# Altium schematic sheet stepsticktester.SchDoc
size 464 x 373 mm
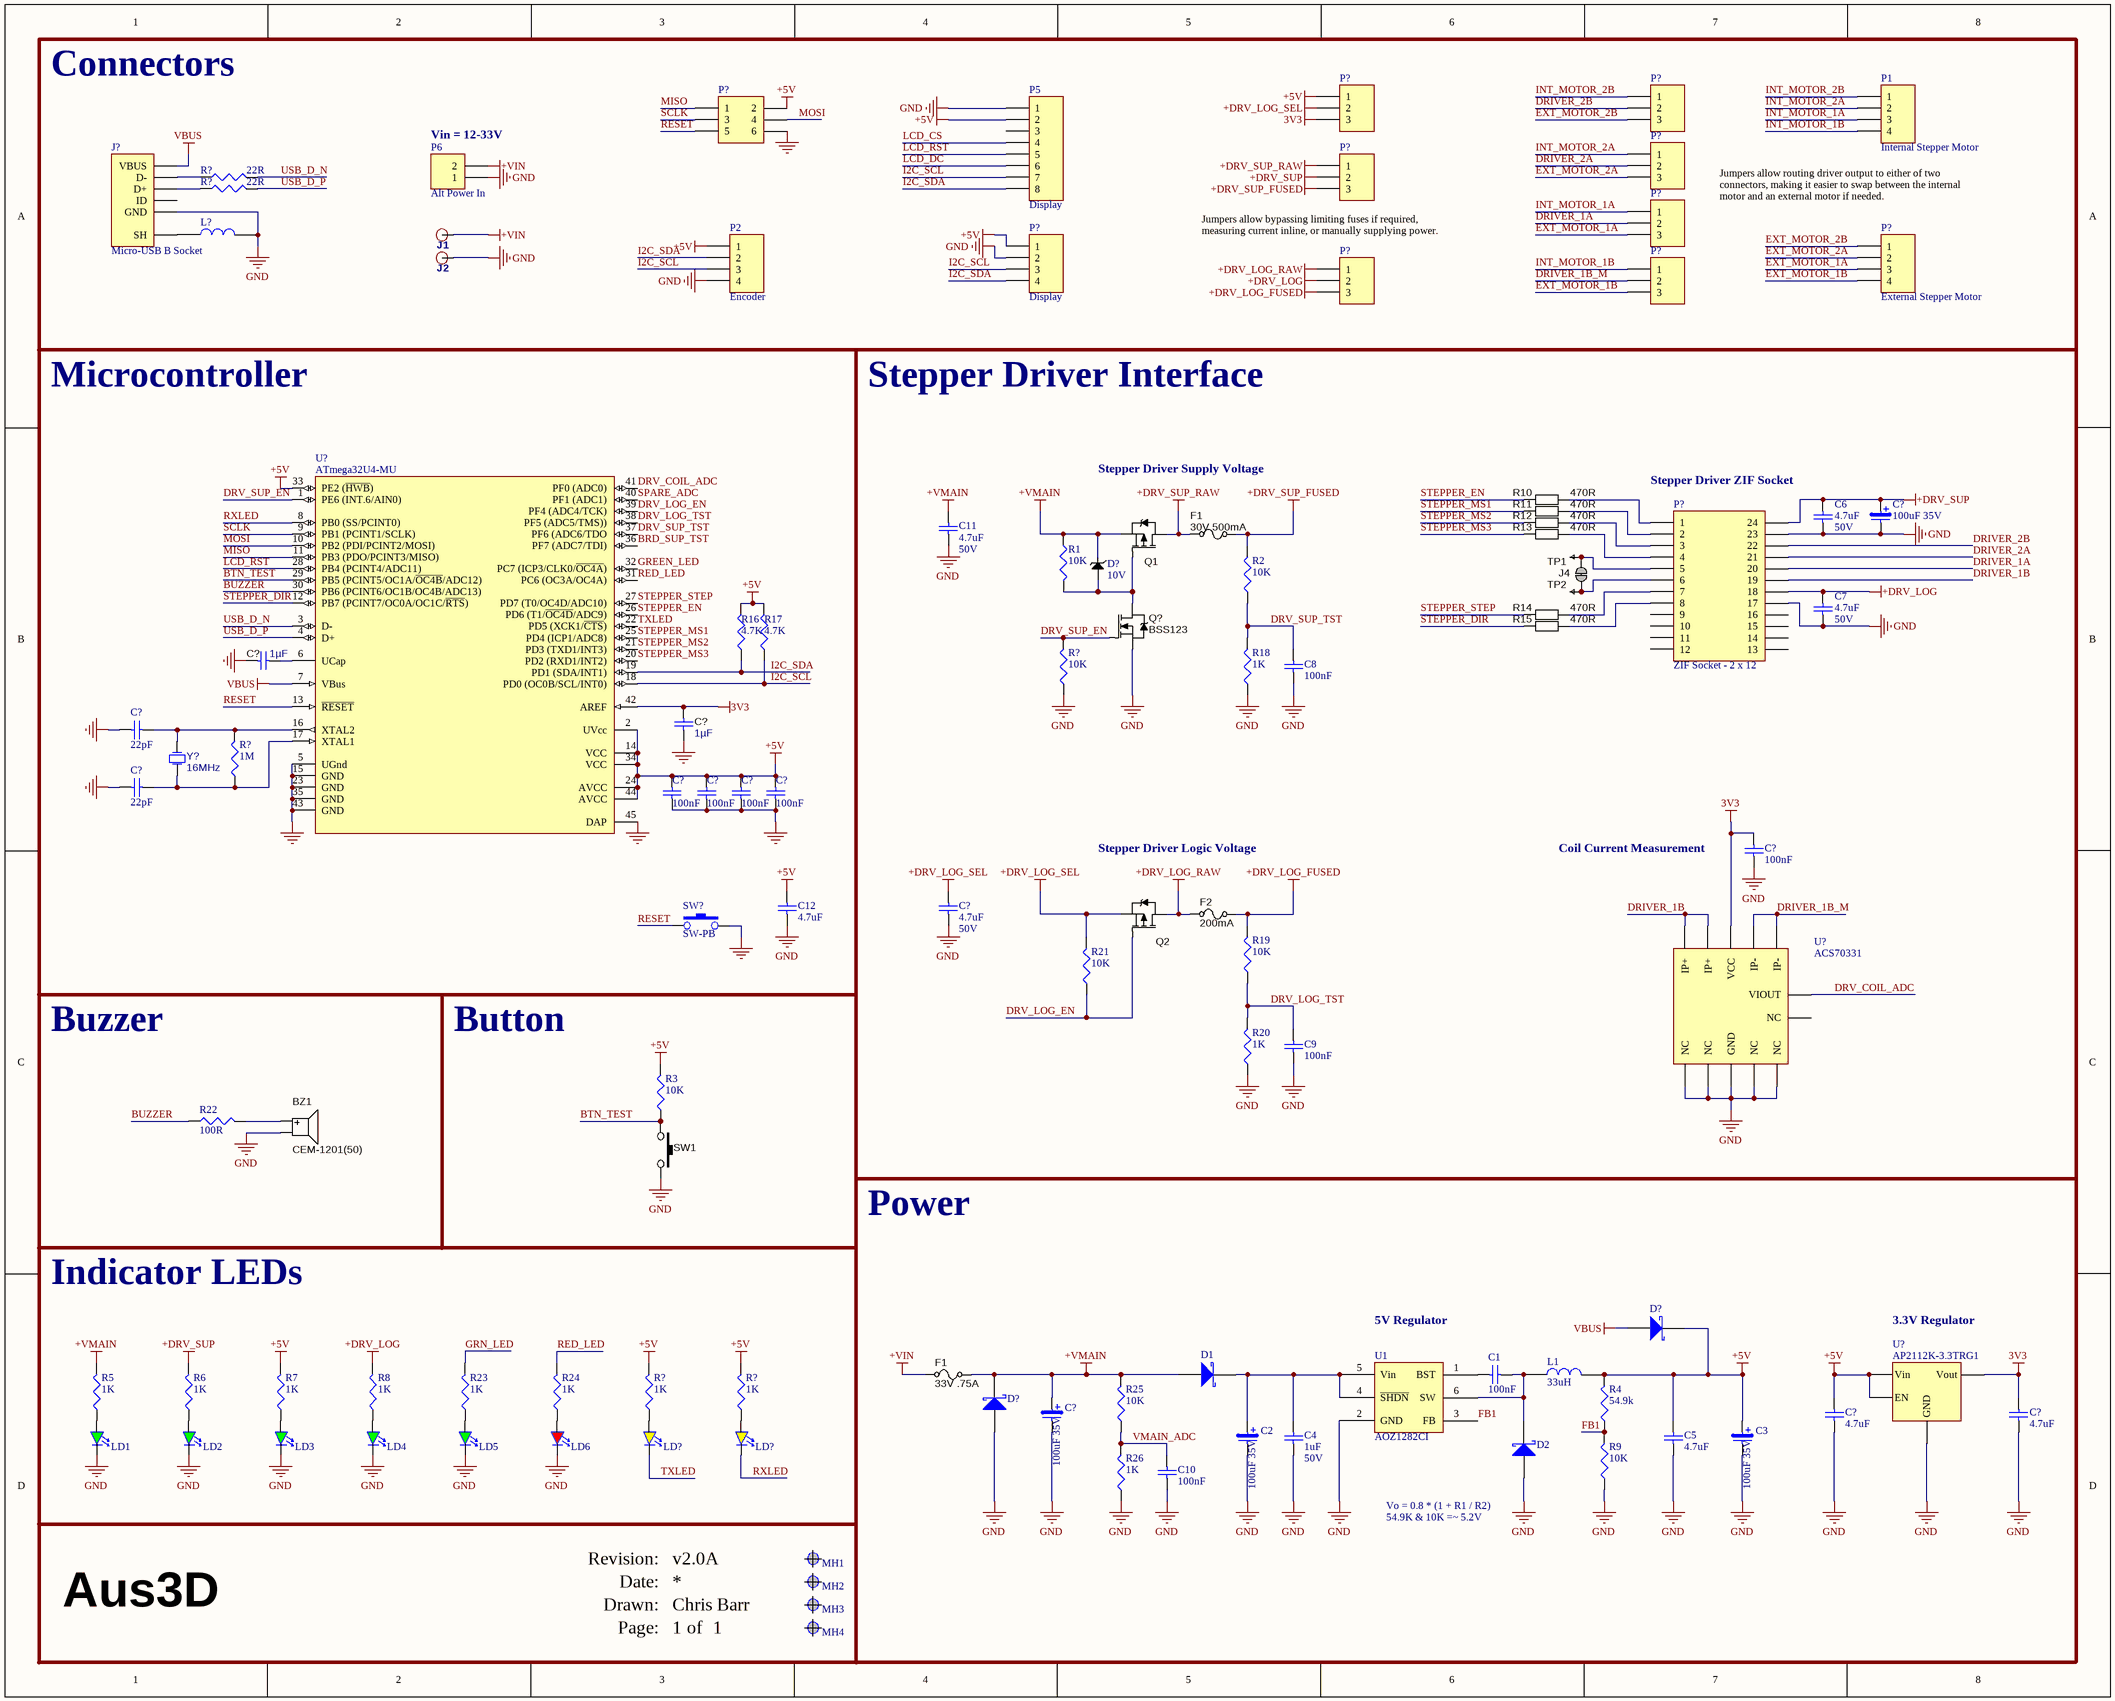
[diagram p0: stepsticktester.SchDoc]

## Parts
(Parts that share a designator on the sheet are numbered #1, #2 ... from top to bottom, then left to right.)
BZ1  Manufacturer Part Number 1: CEM-1201(50)  [BUZZER_12.0X8.5MM]  (hidden comment: 5V Buzzer, 6.5mm TH leads)
C1  value 100nF  [Cap 1608-0603]  (hidden comment: CapC-0603-100nF)
C2  value 100uF 35V  [CAP EL PANASONIC]  (hidden comment: CapE-6.3-100uF-35V)
C3  value 100uF 35V  [CAP EL PANASONIC]  (hidden comment: CapE-6.3-100uF-35V)
C4  value 1uF  Voltage: 50V  [Cap 1608-0603]  (hidden comment: CapC-0603-1uF 50V)
C5  value 4.7uF  [Cap 1608-0603]  (hidden comment: CapC-0603-4.7uF)
C6  value 4.7uF  Voltage: 50V  [CAP 3225-1210]  (hidden comment: CapC-1210-4.7uF-50V)
C7  value 4.7uF  Voltage: 50V  [CAP 3225-1210]  (hidden comment: CapC-1210-4.7uF-50V)
C8  value 100nF  [Cap 1608-0603]  (hidden comment: CapC-0603-100nF)
C9  value 100nF  [Cap 1608-0603]  (hidden comment: CapC-0603-100nF)
C10  value 100nF  [Cap 1608-0603]  (hidden comment: CapC-0603-100nF)
C11  value 4.7uF  Voltage: 50V  [CAP 3225-1210]  (hidden comment: CapC-1210-4.7uF-50V)
C12  value 4.7uF  [Cap 1608-0603]  (hidden comment: CapC-0603-4.7uF)
C?#1  value 100uF 35V  [CAP EL PANASONIC]  (hidden comment: CapE-6.3-100uF-35V)
C?#2  value 1µF  [Cap 1608-0603]  (hidden comment: approved sub OK)
C?#3  value 1µF  [Cap 1608-0603]  (hidden comment: approved sub OK)
C?#4  value 22pF  [Cap 1608-0603]  (hidden comment: CapC-0603-22pF)
C?#5  value 22pF  [Cap 1608-0603]  (hidden comment: CapC-0603-22pF)
C?#6  value 100nF  [Cap 1608-0603]  (hidden comment: CapC-0603-100nF)
C?#7  value 100nF  [Cap 1608-0603]  (hidden comment: CapC-0603-100nF)
C?#8  value 100nF  [Cap 1608-0603]  (hidden comment: CapC-0603-100nF)
C?#9  value 100nF  [Cap 1608-0603]  (hidden comment: CapC-0603-100nF)
C?#10  value 100nF  [Cap 1608-0603]  (hidden comment: CapC-0603-100nF)
C?#11  value 4.7uF  Voltage: 50V  [CAP 3225-1210]  (hidden comment: CapC-1210-4.7uF-50V)
C?#12  value 100uF 35V  [CAP EL PANASONIC]  (hidden comment: CapE-6.3-100uF-35V)
C?#13  value 4.7uF  [Cap 1608-0603]  (hidden comment: CapC-0603-4.7uF)
C?#14  value 4.7uF  [Cap 1608-0603]  (hidden comment: CapC-0603-4.7uF)
D1  Diode Schottky 2A 40V  [DIOM2616X08N]  (value not drawn)
D2  Diode Schottky 2A 40V  [DIOM2616X08N]  (value not drawn)
D?#1  Voltage: 10V  [SOD523]  (hidden comment: Diode Zener 10V)
D?#2  Diode Schottky 2A 40V  [DIOM2616X08N]  (value not drawn)
D?#3  Diode Schottky 2A 40V  [DIOM2616X08N]  (value not drawn)
F1#1  value 30V 500mA  [CAPC4532X280N]  (hidden comment: PTC Resettable Fuse)
F1#2  value 33V .75A  [CAPC4532X280N]  (hidden comment: PTC Resettable Fuse)
F2  value 200mA  [RES 3216-1206]  (hidden comment: PTC Resettable Fuse)
J1  Through-hole banana jack  [BANANA_CONN]  (value not drawn)  (no BOM)
J2  Through-hole banana jack  [BANANA_CONN]  (value not drawn)  (no BOM)
J4  Jumper  [JUMPER-2-NC_BY_PASTE]  (value not drawn)  (no BOM)
J?  Micro-USB B Socket  [Micro-USB B Molex 105017-0001]
L1  value 33uH  [SRN6045TA SMD Inductor]  (hidden comment: Inductor SMD 33uH 2.5A)
L?  Ferrite Bead SMD 0805  [Res 2012-0805]  (value not drawn)
LD1  GREEN  [LED 1608-0603]  (value not drawn)
LD2  GREEN  [LED 1608-0603]  (value not drawn)
LD3  GREEN  [LED 1608-0603]  (value not drawn)
LD4  GREEN  [LED 1608-0603]  (value not drawn)
LD5  GREEN  [LED 1608-0603]  (value not drawn)
LD6  RED  [LED 1608-0603]  (value not drawn)
LD?#1  YELLOW  [LED 1608-0603]  (value not drawn)
LD?#2  YELLOW  [LED 1608-0603]  (value not drawn)
MH1  Screw Hole  [M3-Hole-2]  (value not drawn)  (no BOM)
MH2  Screw Hole  [M3-Hole-2]  (value not drawn)  (no BOM)
MH3  Screw Hole  [M3-Hole-2]  (value not drawn)  (no BOM)
MH4  Screw Hole  [M3-Hole-2]  (value not drawn)  (no BOM)
P1  Internal Stepper Motor  [HDR1X4-HEADER]  (no BOM)
P2  Encoder  [HDR1X4-HEADER]  (no BOM)
P5  Display  [HDR1X8-HEADER]  (no BOM)
P6  Alt Power In  [HDR1X2-HEADER]  (no BOM)
P?#1  Header 3  [HDR1X3-HEADER]  (value not drawn)
P?#2  Header 3  [HDR1X3-HEADER]  (value not drawn)
P?#3  Header 3X2  [HDR2X3-Header]  (value not drawn)
P?#4  Header 3  [HDR1X3-HEADER]  (value not drawn)
P?#5  Header 3  [HDR1X3-HEADER]  (value not drawn)
P?#6  Header 3  [HDR1X3-HEADER]  (value not drawn)
P?#7  Display  [HDR1X4-HEADER]  (no BOM)
P?#8  External Stepper Motor  [HDR1X4-HEADER]  (no BOM)
P?#9  Header 3  [HDR1X3-HEADER]  (value not drawn)
P?#10  Header 3  [HDR1X3-HEADER]  (value not drawn)
P?#11  ZIF Socket - 2 x 12  [ZIF Socket - 2 x 12]
Q1  DMP3099L-7  [SOT23-3 New]  (value not drawn)
Q2  DMP3099L-7  [SOT23-3 New]  (value not drawn)
Q?  BSS123  [SOT23-3]
R1  value 10K  [RES 1608-0603]  (hidden comment: Res-0603-10K)
R2  value 10K  [RES 1608-0603]  (hidden comment: Res-0603-10K)
R3  value 10K  [RES 1608-0603]  (hidden comment: Res-0603-10K)
R4  value 54.9k  [RES 1608-0603]  (hidden comment: Res-0603-54K9)
R5  value 1K  [RES 1608-0603]  (hidden comment: Res-0603-1K)
R6  value 1K  [RES 1608-0603]  (hidden comment: Res-0603-1K)
R7  value 1K  [RES 1608-0603]  (hidden comment: Res-0603-1K)
R8  value 1K  [RES 1608-0603]  (hidden comment: Res-0603-1K)
R9  value 10K  [RES 1608-0603]  (hidden comment: Res-0603-10K)
R10  value 470R  [RESC1608X55N]  (hidden comment: Thick Film)
R11  value 470R  [RESC1608X55N]  (hidden comment: Thick Film)
R12  value 470R  [RESC1608X55N]  (hidden comment: Thick Film)
R13  value 470R  [RESC1608X55N]  (hidden comment: Thick Film)
R14  value 470R  [RESC1608X55N]  (hidden comment: Thick Film)
R15  value 470R  [RESC1608X55N]  (hidden comment: Thick Film)
R16  value 4.7K  [RES 1608-0603]  (hidden comment: Res-0603-4K7)
R17  value 4.7K  [RES 1608-0603]  (hidden comment: Res-0603-4K7)
R18  value 1K  [RES 1608-0603]  (hidden comment: Res-0603-1K)
R19  value 10K  [RES 1608-0603]  (hidden comment: Res-0603-10K)
R20  value 1K  [RES 1608-0603]  (hidden comment: Res-0603-1K)
R21  value 10K  [RES 1608-0603]  (hidden comment: Res-0603-10K)
R22  value 100R  [RES 1608-0603]  (hidden comment: Res-0603-100R)
R23  value 1K  [RES 1608-0603]  (hidden comment: Res-0603-1K)
R24  value 1K  [RES 1608-0603]  (hidden comment: Res-0603-1K)
R25  value 10K  [RES 1608-0603]  (hidden comment: Res-0603-10K)
R26  value 1K  [RES 1608-0603]  (hidden comment: Res-0603-1K)
R?#1  value 22R  [RES 1608-0603]  (hidden comment: Res-0603-22R)
R?#2  value 22R  [RES 1608-0603]  (hidden comment: Res-0603-22R)
R?#3  value 10K  [RES 1608-0603]  (hidden comment: Res-0603-10K)
R?#4  value 1M  [RES 1608-0603]  (hidden comment: Res-0603-1M)
R?#5  value 1K  [RES 1608-0603]  (hidden comment: Res-0603-1K)
R?#6  value 1K  [RES 1608-0603]  (hidden comment: Res-0603-1K)
SW1  Tactile Button - Omron B3F-5050  [Tactile Button - B3F-5050]  (value not drawn)  (no BOM)
SW?  SW-PB  [SW-PB SMD 2pin]
TP1  TESTPOINT  [THP_D38_T75_B75]  (value not drawn)  (no BOM)
TP2  TESTPOINT  [THP_D38_T75_B75]  (value not drawn)  (no BOM)
U1  AOZ1282CI  [SOT23-6N]
U?#1  ATmega32U4-MU  [44PW_N]
U?#2  ACS70331
U?#3  AP2112K-3.3TRG1  [SOT23-5]
Y?  16MHz  [3525 SMD Crystal]

## Blocks framed on the sheet
Connectors: J1 J2 J? L? P1 P2 P5 P6 P?#1-P?#10 R?#1 R?#2
Microcontroller: C12 C?#2-C?#9 R16 R17 R?#4 SW? U?#1 Y?
Stepper Driver Interface: C6-C9 C11 C?#1 C?#10 C?#11 D?#1 F1#1 F2 J4 P?#11 Q1 Q2 Q? R1 R2 R10-R15 R18-R21 R?#3 TP1 TP2 U?#2
Buzzer: BZ1 R22
Button: R3 SW1
Power: C1-C5 C10 C?#12-C?#14 D1 D2 D?#2 D?#3 F1#2 L1 R4 R9 R25 R26 U1 U?#3
Indicator LEDs: LD1-LD6 LD?#1 LD?#2 R5-R8 R23 R24 R?#5 R?#6
Aus3D: MH1-MH4

## Nets
3V3: C?#3.1 C?#10.2 C?#14.2 P?#1.3 U?#1.42(AREF) U?#2.6(VCC) U?#3.5(Vout)
+5V: C3.1 C5.2 C12.2 C?#6.2 C?#7.2 C?#8.2 C?#9.2 C?#13.2 D?#2.K L1.2 P2.1 P5.2 P?#1.1 P?#3.2 P?#7.1 R3.2 R4.2 R7.2 R16.2 R17.2 R?#5.2 R?#6.2 U?#1.2(UVcc) U?#1.14(VCC) U?#1.24(AVCC) U?#1.33(PE2_(~{HWB})) U?#1.34(VCC) U?#1.44(AVCC) U?#3.1(Vin) U?#3.3(EN)
+DRV_LOG: C7.2 P?#9.2 P?#11.18 R8.2
+DRV_LOG_FUSED: F2.2 P?#9.3 R19.2
+DRV_LOG_RAW: F2.1 P?#9.1 Q2.3(D)
+DRV_LOG_SEL: C?#11.2 P?#1.2 Q2.2(S) R21.2
+DRV_SUP: C6.2 C?#1.1 P?#5.2 P?#11.24 R6.2
+DRV_SUP_FUSED: F1#1.2 P?#5.3 R2.2
+DRV_SUP_RAW: F1#1.1 P?#5.1 Q1.3(D)
+VIN: F1#2.1 J1.P$1 P6.2
+VMAIN: C11.2 C?#12.1 D1.A D?#1.K D?#3.K F1#2.2 Q1.2(S) R1.1 R5.2 R25.2
GND: BZ1.2(Negative) C2.2 C3.2 C4.1 C5.1 C6.1 C7.1 C8.2 C9.2 C10.2 C11.1 C12.1 C?#1.2 C?#2.1 C?#3.2 C?#4.2 C?#5.2 C?#6.1 C?#7.1 C?#8.1 C?#9.1 C?#10.1 C?#11.1 C?#12.2 C?#13.1 C?#14.1 D2.A D?#3.A J2.P$1 J?.GND L?.2 LD1.2(K) LD2.2(K) LD3.2(K) LD4.2(K) LD5.2(K) LD6.2(K) P2.4 P5.1 P6.1 P?#3.6 P?#7.2 P?#11.17 P?#11.23 Q?.2(S) R9.1 R18.1 R20.1 R26.1 R?#3.1 SW1.1 SW?.2 U1.2(GND) U?#1.5(UGnd) U?#1.15(GND) U?#1.23(GND) U?#1.35(GND) U?#1.43(GND) U?#1.45(DAP) U?#2.5(GND) U?#2.6(NC) U?#2.8(NC) U?#2.9(NC) U?#2.11(NC) U?#3.2(GND)
VBUS: D?#2.A J?.VBUS U?#1.7(VBus)
BRD_SUP_TST: U?#1.36(PF7_(ADC7/TDI))
BTN_TEST: R3.1 SW1.2 U?#1.29(PB5_(PCINT5/OC1A/~{OC4B}/ADC12))
BUZZER: R22.1 U?#1.30(PB6_(PCINT6/OC1B/OC4B/ADC13))
DRIVER_1A: P?#6.2 P?#11.20
DRIVER_1B: P?#11.19 U?#2.1(IP+) U?#2.2(IP+)
DRIVER_1B_M: P?#10.2 U?#2.3(IP-) U?#2.4(IP-)
DRIVER_2A: P?#4.2 P?#11.21
DRIVER_2B: P?#2.2 P?#11.22
DRV_COIL_ADC: U?#1.41(PF0_(ADC0)) U?#2.10(VIOUT)
DRV_LOG_EN: Q2.1(G) R21.1 U?#1.39(PF4_(ADC4/TCK))
DRV_LOG_TST: C9.1 R19.1 R20.2 U?#1.38(PF5_(ADC5/TMS)))
DRV_SUP_EN: Q?.1(G) R?#3.2 U?#1.1(PE6_(INT.6/AIN0))
DRV_SUP_TST: C8.1 R2.1 R18.2 U?#1.37(PF6_(ADC6/TDO)
EXT_MOTOR_1A: P?#6.3 P?#8.3
EXT_MOTOR_1B: P?#8.4 P?#10.3
EXT_MOTOR_2A: P?#4.3 P?#8.2
EXT_MOTOR_2B: P?#2.3 P?#8.1
FB1: R4.1 R9.2 U1.3(FB)
GREEN_LED: U?#1.32(PC7_(ICP3/CLK0/~{OC4A}))
GRN_LED: R23.2
I2C_SCL: P2.3 P5.7 P?#7.3 R17.1 U?#1.18(PD0_(OC0B/SCL/INT0))
I2C_SDA: P2.2 P5.8 P?#7.4 R16.1 U?#1.19(PD1_(SDA/INT1))
INT_MOTOR_1A: P1.3 P?#6.1
INT_MOTOR_1B: P1.4 P?#10.1
INT_MOTOR_2A: P1.2 P?#4.1
INT_MOTOR_2B: P1.1 P?#2.1
LCD_CS: P5.4
LCD_DC: P5.6
LCD_RST: P5.5 U?#1.28(PB4_(PCINT4/ADC11))
MISO: P?#3.1 U?#1.11(PB3_(PDO/PCINT3/MISO))
MOSI: P?#3.4 U?#1.10(PB2_(PDI/PCINT2/MOSI))
RED_LED: R24.2 U?#1.31(PC6_(OC3A/OC4A))
RESET: P?#3.5 SW?.1 U?#1.13(~{RESET})
RXLED: LD?#2.2(K) U?#1.8(PB0_(SS/PCINT0))
SCLK: P?#3.3 U?#1.9(PB1_(PCINT1/SCLK))
SPARE_ADC: U?#1.40(PF1_(ADC1))
STEPPER_DIR: R15.1 U?#1.12(PB7_(PCINT7/OC0A/OC1C/~{RTS}))
STEPPER_EN: R10.1 U?#1.26(PD6_(T1/~{OC4D}/ADC9))
STEPPER_MS1: R11.1 U?#1.25(PD4_(ICP1/ADC8))
STEPPER_MS2: R12.1 U?#1.21(PD3_(TXD1/INT3))
STEPPER_MS3: R13.1 U?#1.20(PD2_(RXD1/INT2))
STEPPER_STEP: R14.1 U?#1.27(PD7_(T0/OC4D/ADC10))
TXLED: LD?#1.2(K) U?#1.22(PD5_(XCK1/~{CTS}))
USB_D_N: R?#1.2 U?#1.3(D-)
USB_D_P: R?#2.2 U?#1.4(D+)
VMAIN_ADC: C10.1 R25.1 R26.2
NetBZ1_1: BZ1.1(Positive) R22.2
NetC1_1: C1.1 D2.K L1.1 U1.6(SW)
NetC1_2: C1.2 U1.1(BST)
NetC2_1: C2.1 C4.2 D1.K U1.4(~{SHDN}) U1.5(Vin)
NetC?#2_2: C?#2.2 U?#1.6(UCap)
NetC?#4_1: C?#4.1 R?#4.2 U?#1.16(XTAL2) Y?.3(OSC2)
NetC?#5_1: C?#5.1 R?#4.1 U?#1.17(XTAL1) Y?.1(OSC1)
NetD?#1_A: D?#1.A Q1.1(G) Q?.3(D) R1.2
NetJ4_1: J4.1 P?#11.5 TP1.1
NetJ4_2: J4.2 P?#11.6 TP2.1
NetJ?_D+: J?.D+ R?#2.1
NetJ?_D-: J?.D- R?#1.1
NetJ?_SHIELD: J?.SHIELD(SH) L?.1
NetLD1_1: LD1.1(A) R5.1
NetLD2_1: LD2.1(A) R6.1
NetLD3_1: LD3.1(A) R7.1
NetLD4_1: LD4.1(A) R8.1
NetLD5_1: LD5.1(A) R23.1
NetLD6_1: LD6.1(A) R24.1
NetLD?#1_1: LD?#1.1(A) R?#5.1
NetLD?#2_1: LD?#2.1(A) R?#6.1
NetP?#11_1: P?#11.1 R10.2
NetP?#11_2: P?#11.2 R11.2
NetP?#11_3: P?#11.3 R12.2
NetP?#11_4: P?#11.4 R13.2
NetP?#11_7: P?#11.7 R14.2
NetP?#11_8: P?#11.8 R15.2

Not connected (* = marked no-connect by the designer): J? ID; MH1 M3(0); MH2 M3(0); MH3 M3(0); MH4 M3(0); P5 3; P?#11 9 10 11 12 13 14 15 16; U?#2 7(NC)

## Notes on the sheet
- (near P6) Vin = 12-33V
- Jumpers allow routing driver output to either of two connectors, making it easier to swap between the internal motor and an external motor if needed.
- (near P?#5) Jumpers allow bypassing limiting fuses if required, measuring current inline, or manually supplying power.
- Stepper Driver Supply Voltage
- Stepper Driver ZIF Socket
- Stepper Driver Logic Voltage
- Coil Current Measurement
- 5V Regulator
- 3.3V Regulator
- Vo = 0.8 * (1 + R1 / R2)
- 54.9K & 10K =~ 5.2V
- Date:
- Revision:
- v2.0A
- Drawn:
- Page:
- Chris Barr
- 1
- of

## Library data of the parts
BZ1 = BZ_12x8.5x6.5_2kHz: Speaker, Magnetic Transducer; Manufacturer 1: CUI Inc; Ratings: 2048 ±200 Hz; SCDType: source; Substitute: Sub OK; Package / Case: 6.5mm pitch; Material: Noryl SE1-J; Supplier 1: Digi-Key; Supplier Part Number 1: 102-1152-ND
C1 C8-C10 = CapC-0603-100nF: Capacitor (Semiconductor SIM Model); Note: Approved sub OK; Substitute: Sub OK; Published: 8-Jun-2000; Revision: July-2002: Re-released for DXP Platform.; Publisher: Altium Limited; Supplier 1: Digi-Key; Supplier Part Number 1: 311-1344-1-ND
C2 C3 C?#1 C?#12 = CapE-6.3-100uF-35V: Polarized Capacitor (Surface Mount); Note: Approved sub OK; Substitute: Sub OK; Published: 8-Jun-2000; Revision: July-2002: Re-released for DXP Platform.; Publisher: Altium Limited; Supplier 1: Digi-Key; Supplier Part Number 1: PCE5016CT-ND
C4 = CapC-0603-1uF 50V: Capacitor (Semiconductor SIM Model); Note: Approved sub OK; Substitute: Sub OK; Published: 8-Jun-2000; Revision: July-2002: Re-released for DXP Platform.; Publisher: Altium Limited; Supplier 1: Digi-Key; Supplier Part Number 1: 1276-1860-1-ND
C5 C12 C?#13 C?#14 = CapC-0603-4.7uF: Capacitor (Semiconductor SIM Model); Note: Approved sub OK; Substitute: Sub OK; Published: 8-Jun-2000; Revision: July-2002: Re-released for DXP Platform.; Publisher: Altium Limited; Supplier 1: Digi-Key; Supplier Part Number 1: 311-1521-1-ND
C6 C7 = CapC-1210-4.7uF-50V: Capacitor (Semiconductor SIM Model); Note: Approved sub OK; Published: 8-Jun-2000; Revision: July-2002: Re-released for DXP Platform.; Publisher: Altium Limited; Supplier 1: Digi-Key; Supplier Part Number 1: 490-1864-1-ND
C11 C?#11 = CapC-1210-4.7uF-50V: Capacitor (Semiconductor SIM Model); Note: Approved sub OK; Substitute: Sub OK; Published: 8-Jun-2000; Revision: July-2002: Re-released for DXP Platform.; Publisher: Altium Limited; Supplier 1: Digi-Key; Supplier Part Number 1: 490-1864-1-ND
C?#2 C?#3 = CAPC_1u_0603_X7R_16V_10%: Capacitor SMD Cer 1uF 10% 16V X7R 0603; Manufacturer 1: TDK Corporation; Manufacturer Part Number 1: C1608X7R1C105K; Ratings: 16V; X7R; Material: ceramic; SCDType: spec; Package / Case: 0603 (1608 metric); Tolerance: ±10%; Supplier 1: Digi-Key; Supplier Part Number 1: 445-1604-1-ND; ComponentLink1URL: http://product.tdk.com/capacitor/mlcc/en/documents/mlcc_commercial_general_en.pdf; ComponentLink1Description: http://product.tdk.com/capacitor/mlcc/en/documents/mlcc_commercial_general_en.pdf; Note: Approved sub OK
C?#4 C?#5 = CapC-0603-22pF: Capacitor (Semiconductor SIM Model); Note: Approved sub OK; Published: 8-Jun-2000; Revision: July-2002: Re-released for DXP Platform.; Publisher: Altium Limited; Supplier 1: Digi-Key; Supplier Part Number 1: 478-6204-1-ND
C?#6-C?#10 = CapC-0603-100nF: Capacitor (Semiconductor SIM Model); Note: Approved sub OK; Published: 8-Jun-2000; Revision: July-2002: Re-released for DXP Platform.; Publisher: Altium Limited; Supplier 1: Digi-Key; Supplier Part Number 1: 311-1344-1-ND
D1 D2 D?#2 D?#3 = Diode Schottky 2A 40V: Default Diode; Code - JEDEC: DO-214-AB; Note: Approved sub OK; Substitute: Sub OK; Published: 8-Jun-2000; Revision: July-2002: Re-released for DXP Platform.; Publisher: Altium Limited; Supplier 1: Digi-Key; Supplier Part Number 1: DB2W40200LCT-ND
D?#1 = Diode Zener 10V: Default Diode; Code - JEDEC: DO-214-AB; Note: Approved sub OK; Published: 8-Jun-2000; Revision: July-2002: Re-released for DXP Platform.; Publisher: Altium Limited; Supplier 1: Digi-Key; Supplier Part Number 1: DZ2S100M0LCT-ND
F1#1 = Fuse - 30V .5A Hold 1A Trip PTC SMD 1812: SCDType: spec; Package / Case: 2920 (7351 metric); Supplier 1: Digi-Key; Supplier Part Number 1: 507-1762-1-ND
F1#2 = Fuse - 33V .75A Hold 1.5A Trip PTC SMD 1812: SCDType: spec; Package / Case: 2920 (7351 metric); Supplier 1: Digi-Key; Supplier Part Number 1: 507-1765-1-ND
F2 = Fuse - 30V 400mA Trip PTC SMD 1206: Substitute: Sub OK; Package / Case: 1206 (3216 metric); Supplier 1: Digi-Key; Supplier Part Number 1: 507-1797-1-ND
J1 J2 = BANANA_CONN
J4 = JUMP1-NC: SMD jumper
J? = Micro-USB B Socket: Note: Approved sub OK; Supplier 1: Digi-Key; Supplier Part Number 1: WM1399CT-ND
L1 = Inductor SMD 33uH 2.5A: MagneticCore Inductor with Winding Polarity Marking; Note: Approved sub OK; Substitute: Sub OK; Published: 24-Mar-1999; Revision: July-2002: Re-released for DXP Platform.; Publisher: Altium Limited; Supplier 1: Digi-Key; Supplier Part Number 1: SRN6045TA-330MCT-ND
L? = Ferrite Bead SMD 0805: MagneticCore Inductor with Winding Polarity Marking; Value: WE-CBF_0805 (WE-CBF); Note: Approved sub OK; Published: 24-Mar-1999; Revision: July-2002: Re-released for DXP Platform.; Publisher: Altium Limited; Supplier 1: Digi-Key; Supplier Part Number 1: 490-1054-1-ND
LD1-LD5 = LEDG  0603: Hyper-Bright LED; Note: Approved sub OK; Substitute: Sub OK; Supplier 1: Digi-Key; Supplier Part Number 1: 160-1435-2-ND
LD6 = LEDR  0603: Hyper-Bright LED; Note: Approved sub OK; Substitute: Sub OK; Supplier 1: Digi-Key; Supplier Part Number 1: 160-1435-2-ND
LD?#1 LD?#2 = LEDY  0603: Hyper-Bright LED; Note: Approved sub OK; Supplier 1: Digi-Key; Supplier Part Number 1: 160-1437-1-ND
P1 P2 P?#7 P?#8 = Header 4: Header, 4-Pin; Note: Approved sub OK; LatestRevisionDate: 17-Jul-2002; LatestRevisionNote: Re-released for DXP Platform.; Publisher: Altium Limited; Supplier 1: Digi-Key; Supplier Part Number 1: 3M9449-ND
P5 = Header 8x1: Header, 8-Pin; Note: Approved sub OK; LatestRevisionDate: 17-Jul-2002; LatestRevisionNote: Re-released for DXP Platform.; Publisher: Altium Limited; Supplier 1: Digi-Key; Supplier Part Number 1: 3M9449-ND
P6 = Header 2: Header, 2-Pin; Note: Approved sub OK; LatestRevisionDate: 17-Jul-2002; LatestRevisionNote: Re-released for DXP Platform.; Publisher: Altium Limited; Supplier 1: Digi-Key; Supplier Part Number 1: 3M9447-ND
P?#1 P?#2 P?#4-P?#6 P?#9 P?#10 = Header 3: Header, 3-Pin; Note: Approved sub OK; LatestRevisionDate: 17-Jul-2002; LatestRevisionNote: Re-released for DXP Platform.; Publisher: Altium Limited; Supplier 1: Digi-Key; Supplier Part Number 1: 3M9448-ND
P?#3 = Header 3X2: Header, 3-Pin, Dual row; Note: Approved sub OK; LatestRevisionDate: 17-Jul-2002; LatestRevisionNote: Re-released for DXP Platform.; Publisher: Altium Limited; Supplier 1: Digi-Key; Supplier Part Number 1: 3M9459-ND
Q1 Q2 = MOSFET SMD P-CH 20V 3.8A TSOT-23-6: MOSFET SMD P-CH 20V 3.8A SOT-23-3; FET Type: MOSFET P-Channel, Metal Oxide; Substitute: Sub OK; Supplier 1: Digi-Key; Supplier Part Number 1: DMP3099L-7DICT-ND
Q? = MOSFET_BSS123: MOSFET SMD N-CH 100V 170mA SOT23-3; Manufacturer 1: Diodes Inc; Manufacturer Part Number 1: BSS123-7-F; Ratings: 100V; 170mA; Material: Metal Oxide; SCDType: source; Package / Case: SOT23-3; Supplier 1: Digi-Key; Supplier Part Number 1: BSS123-FDICT-ND
R1 R3 R4 R9 R21 R?#3 = Res-0603-10K: Resistor; Note: Approved sub OK; Substitute: Sub OK; Published: 8-Jun-2000; Revision: July-2002: Re-released for DXP Platform.; Publisher: Altium Limited; Supplier 1: Digi-Key; Supplier Part Number 1: 311-10.0KHRCT-ND
R2 R19 R25 = Res-0603-10K: Resistor; Note: Approved sub OK; Published: 8-Jun-2000; Revision: July-2002: Re-released for DXP Platform.; Publisher: Altium Limited; Supplier 1: Digi-Key; Supplier Part Number 1: 311-10.0KHRCT-ND
R5-R8 R18 R20 R23 R24 R26 R?#5 R?#6 = Res-0603-1K: Resistor; Note: Approved sub OK; Substitute: Sub OK; Published: 8-Jun-2000; Revision: July-2002: Re-released for DXP Platform.; Publisher: Altium Limited; Supplier 1: Digi-Key; Supplier Part Number 1: 311-1.00KHRCT-ND
R10-R15 = RES_470R_0603_5%: Resistor SMD chip 470 Ohm 0.1W 5% 0603; Manufacturer 1: Vishay/Dale; Manufacturer Part Number 1: CRCW0603470RJNEA; Ratings: 1/10 W; SCDType: spec; Substitute: Sub OK; Package / Case: 0603 (1608 metric); Tolerance: ±5%; Material: Thick Film; Supplier 1: Digi-Key; Supplier Part Number 1: 541-470GCT-ND
R16 R17 = Res-0603-4K7: Resistor; Note: Approved sub OK; Substitute: Sub OK; Published: 8-Jun-2000; Revision: July-2002: Re-released for DXP Platform.; Publisher: Altium Limited; Supplier 1: Digi-Key; Supplier Part Number 1: 311-4.7KGRCT-ND
R22 = Res-0603-100R: Resistor; Note: Approved sub OK; Substitute: Sub OK; Published: 8-Jun-2000; Revision: July-2002: Re-released for DXP Platform.; Publisher: Altium Limited; Supplier 1: Digi-Key; Supplier Part Number 1: 311-100HRCT-ND
R?#1 R?#2 = Res-0603-22R: Resistor; Note: Approved sub OK; Published: 8-Jun-2000; Revision: July-2002: Re-released for DXP Platform.; Publisher: Altium Limited; Supplier 1: Digi-Key; Supplier Part Number 1: 311-22.0HRCT-ND
R?#4 = Res-0603-1M: Resistor; Note: Approved sub OK; Published: 8-Jun-2000; Revision: July-2002: Re-released for DXP Platform.; Publisher: Altium Limited; Supplier 1: Digi-Key; Supplier Part Number 1: 311-1.00MHRDKR-ND
SW1 = Tactile Button - Omron B3F-5050: Function: On/Off; SCDType: source*; Substitute: Sub OK; Package / Case: 6.0x6.0mm; 8.0mm stem; Material: Brass/Nylon/Ag plating; Supplier 1: Digi-Key; Supplier Part Number 1: SW801-ND
SW? = SW-PB: SMD Button; Note: Approved sub OK; Supplier 1: Digi-Key; Supplier Part Number 1: 679-2396-1-ND
TP1 TP2 = TESTPOINT: SMD test pin
U1 = Buck Regulator AOZ1282CI: Supplier 1: Digi-Key; Supplier Part Number 1: 785-1613-1-ND
U?#1 = ATmega32U4-MU: 8-bit AVR Microcontroller, 2.7-5.5V, 16MHz, 32KB Flash, 1KB EEPROM, 2.5KB SRAM, USB Controller, 44-pin QFN, Industrial Grade (-40°C to 85°C), Ext Osc; DatasheetVersion: revF, Nov-2010; PackageVersion: revG, Sep-2009; PackageReference: 44PW; PackageDescription: 44-Pin Quad Flat No-Lead Package, 7 x 7 mm Body, 0.5 mm Pitch (QFN); Code_JEDEC: MO-220-VKKD-1; ComponentLink1Description: Manufacturer URL; ComponentLink1URL: http://www.atmel.com/; ComponentLink2Description: ATmega16U4/32U4 Datasheet; ComponentLink2URL: http://www.atmel.com/dyn/resources/prod_documents/doc7766.pdf; ComponentLink3Description: ATmega16U4 ATmega32U4 Summary; ComponentLink3URL: http://www.atmel.com/dyn/resources/prod_documents/7766S.pdf
U?#2 = Current Sensor - Allegro ACS70331: Supplier 1: Digi-Key; Supplier Part Number 1: 620-1887-1-ND
U?#3 = Regulator - AP2112K 3.3V Linear Regulator: 3.3V LDO Regulator; Supplier 1: Digi-Key; Supplier Part Number 1: AP2112K-3.3TRG1DICT-ND
Y? = XTAL_2: Crystal Oscillator; Manufacturer: Generic Components; Published: 08/06/2000; Publisher: Altium Hobart Technology Centre; Class: Oscillator; SubClass: Crystal Oscillator; Supplier 1: Digi-Key; Supplier Part Number 1: SER3686CT-ND